# EAGLE board boardV1-4 (EAGLE 6.5.0), part 1 of 2
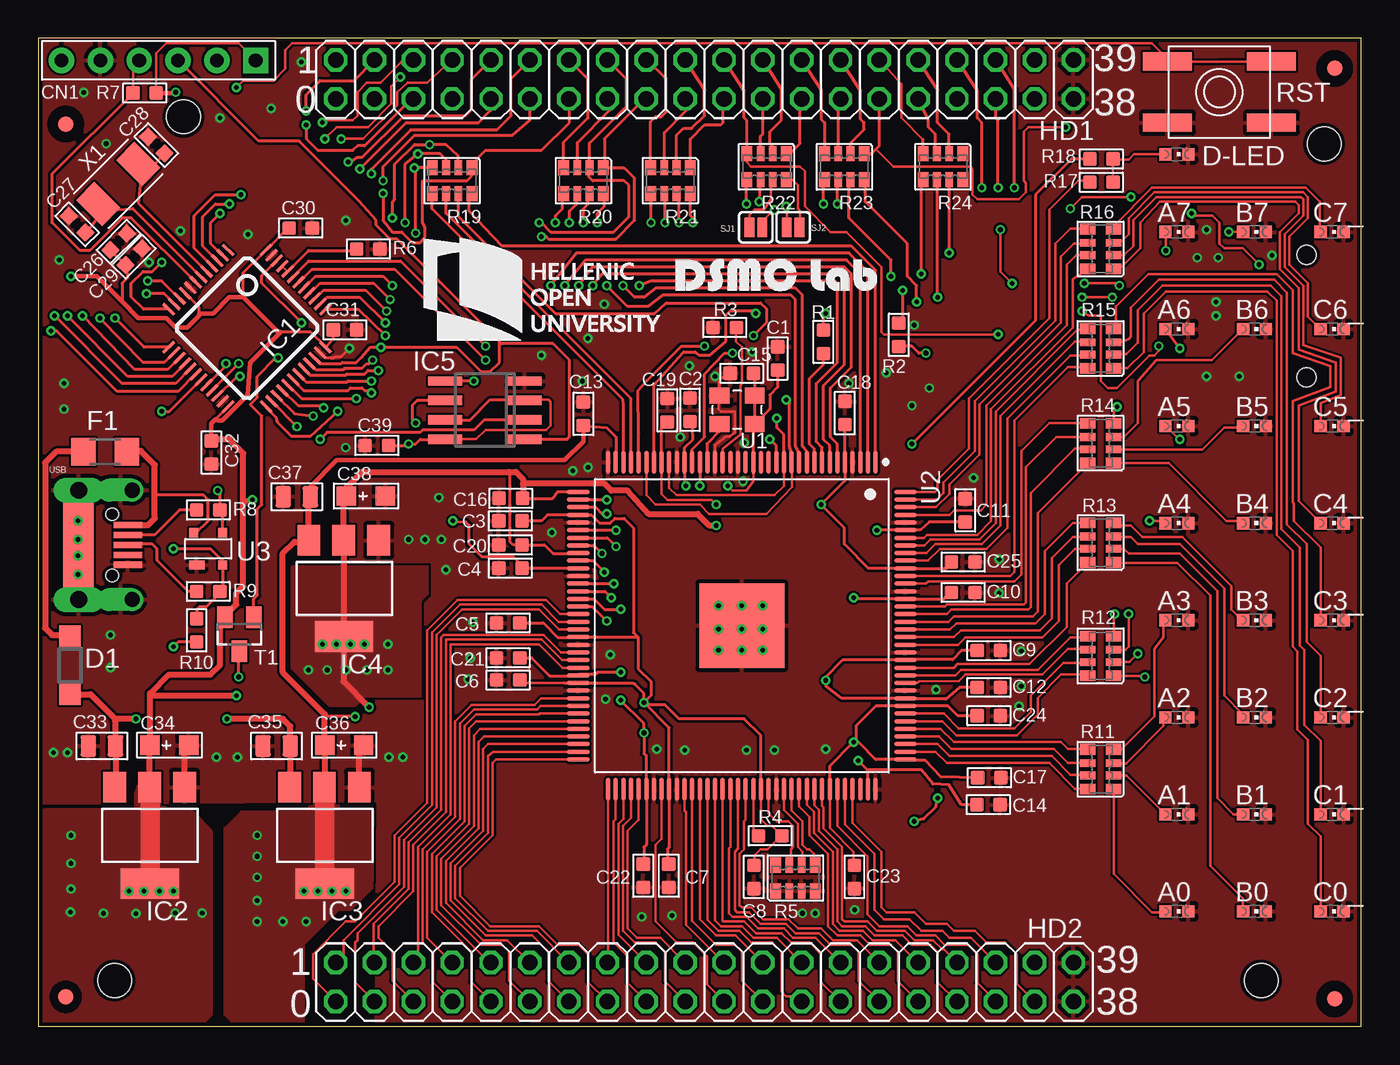
[diagram p7: board, top side]
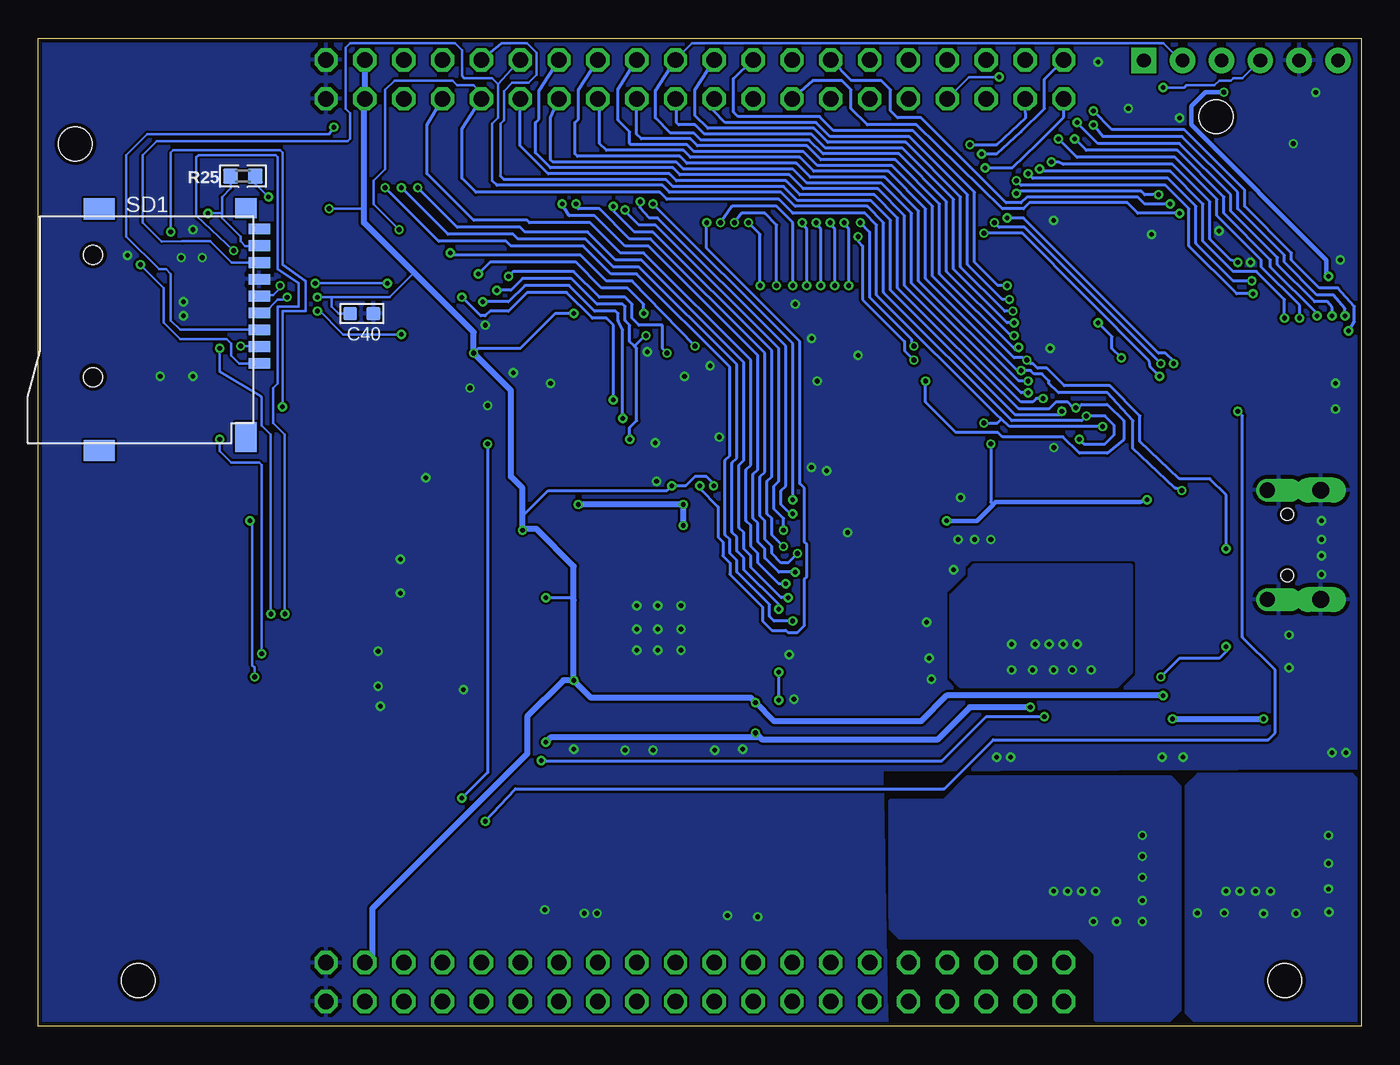
[diagram p8: board, bottom side, seen from below]

Size 86.54 x 64.64 mm. Coordinates in mm from the lower left corner, seen from the top.
Outline: 0,0 86.54,0 86.54,64.64 0,64.64 0,0
Copper layers (1*16): Top 0.035mm / dielectric 1.5mm / Bottom 0.035mm
Design rules "SeeedStudio_2layer_DRU_no_angle_20140221": minimum track width 6mil, minimum drill 12mil, track to track 6mil, track to pad 6mil, pad to pad 6mil, via to via 6mil, smd to smd 0mil, copper to edge 10mil, drill to drill 10mil, minimum pad ring 10mil, minimum via ring 6mil, stop-mask expansion 2mil, vias tented up to drill 100mil, thermal gap 10mil
Holes 2.2 mm at 5,3 80,3 84.11,57.73 9.5,59.5

## Footprints (pad centres in the part's own frame; a part is rotated, then mirrored left to right if it is on the bottom)
CHIPLED_0603 = smd 0.8 x 0.8: A 0,-0.75; C 0,0.75
C0603 = smd 0.889 x 0.889: 1 0,0.762; 2 0,-0.762
C0805 = smd 1.397 x 1.016: 1 0,0.889; 2 0,-0.889
AVX-A = smd 1.27 x 1.27: + -1.27,0; - 1.27,0
H6-2.54 = drill 0.889 pad 1.651 square: 1 0,6.35 | drill 0.889 pad 1.651: 2 0,3.81; 3 0,1.27; 4 0,-1.27; 5 0,-3.81; 6 0,-6.35
SOD123 = smd 1.4 x 1.4: A 1.9,0; C -1.9,0
R1206 = smd 1.6 x 1.803: 1 -1.422,0; 2 1.422,0
2X20 = drill 1.016 octagon: 1 -24.13,-1.27; 2 -24.13,1.27; 3 -21.59,-1.27; 4 -21.59,1.27; 5 -19.05,-1.27; 6 -19.05,1.27; 7 -16.51,-1.27; 8 -16.51,1.27; 9 -13.97,-1.27; 10 -13.97,1.27; 11 -11.43,-1.27; 12 -11.43,1.27; 13 -8.89,-1.27; 14 -8.89,1.27; 15 -6.35,-1.27; 16 -6.35,1.27; 17 -3.81,-1.27; 18 -3.81,1.27; 19 -1.27,-1.27; 20 -1.27,1.27; 21 1.27,-1.27; 22 1.27,1.27; 23 3.81,-1.27; 24 3.81,1.27; 25 6.35,-1.27; 26 6.35,1.27; 27 8.89,-1.27; 28 8.89,1.27; 29 11.43,-1.27; 30 11.43,1.27; 31 13.97,-1.27; 32 13.97,1.27; 33 16.51,-1.27; 34 16.51,1.27; 35 19.05,-1.27; 36 19.05,1.27; 37 21.59,-1.27; 38 21.59,1.27; 39 24.13,-1.27; 40 24.13,1.27
TQFP48 = smd 0.2 x 1: 1 -2.75,-4.5; 2 -2.25,-4.5; 3 -1.75,-4.5; 4 -1.25,-4.5; 5 -0.75,-4.5; 6 -0.25,-4.5; 7 0.25,-4.5; 8 0.75,-4.5; 9 1.25,-4.5; 10 1.75,-4.5; 11 2.25,-4.5; 12 2.75,-4.5; 25 2.75,4.5; 26 2.25,4.5; 27 1.75,4.5; 28 1.25,4.5; 29 0.75,4.5; 30 0.25,4.5; 31 -0.25,4.5; 32 -0.75,4.5; 33 -1.25,4.5; 34 -1.75,4.5; 35 -2.25,4.5; 36 -2.75,4.5 | smd 1 x 0.2: 13 4.5,-2.75; 14 4.5,-2.25; 15 4.5,-1.75; 16 4.5,-1.25; 17 4.5,-0.75; 18 4.5,-0.25; 19 4.5,0.25; 20 4.5,0.75; 21 4.5,1.25; 22 4.5,1.75; 23 4.5,2.25; 24 4.5,2.75; 37 -4.5,2.75; 38 -4.5,2.25; 39 -4.5,1.75; 40 -4.5,1.25; 41 -4.5,0.75; 42 -4.5,0.25; 43 -4.5,-0.25; 44 -4.5,-0.75; 45 -4.5,-1.25; 46 -4.5,-1.75; 47 -4.5,-2.25; 48 -4.5,-2.75
SOT223 = smd 1.499 x 2.007: 1 -2.261,-3.15; 2 0.025,-3.15; 3 2.311,-3.15 | smd 3.81 x 2.007: 4 0,3.15
SO08 = smd 0.6 x 2.2: 1 -1.905,-2.6; 2 -0.635,-2.6; 3 0.635,-2.6; 4 1.905,-2.6; 5 1.905,2.6; 6 0.635,2.6; 7 -0.635,2.6; 8 -1.905,2.6
R0603 = smd 0.889 x 0.889: 1 0,0.762; 2 0,-0.762
RA1206-8 = smd 0.7 x 1: 1 -1.3,-0.85; 4 1.3,-0.85; 5 1.3,0.85; 8 -1.3,0.85 | smd 0.5 x 1: 2 -0.4,-0.85; 3 0.4,-0.85; 6 0.4,0.85; 7 -0.4,0.85
0603$1 = smd 1 x 1: 1 -0.8,0; 2 0.8,0
EVQ-Q2 = smd 3.2 x 1.2: A -3.4,-2; A' 3.4,-2; B -3.4,2; B' 3.4,2
TF-PULL = smd 0.7 x 1.4: 1 -2.2,-7.62; 2 -1.1,-7.62; 3 0,-7.62; 4 1.1,-7.62; 5 2.2,-7.62; 6 3.3,-7.62; 7 4.4,-7.62; 8 5.5,-7.62; 9 6.6,-7.62 | smd 1.4 x 2: S1 -7.9,2.85; S2 7.9,2.85 | smd 1.28 x 1.4: S3 7.96,-6.75 | smd 1.95 x 1.4: S4 -7.025,-6.75 | hole 1.25: -3.1,3.25; 4.9,3.25
SPARKFUN_SJ_2S = smd 0.635 x 1.27: 1 -0.412,0; 2 0.412,0
SOT23 = smd 1 x 1.4: 1 -0.95,-1.1; 2 0.95,-1.1; 3 0,1.1
X3225_4P = smd 1.3 x 1.05: P$1 -1.15,-0.925; P$2 1.15,-0.925; P$3 1.15,0.925; P$4 -1.15,0.925
QFP50P2200X2200X165-145N = smd 1.5 x 0.3: 1 -10.7,8.75; 2 -10.7,8.25; 3 -10.7,7.75; 4 -10.7,7.25; 5 -10.7,6.75; 6 -10.7,6.25; 7 -10.7,5.75; 8 -10.7,5.25; 9 -10.7,4.75; 10 -10.7,4.25; 11 -10.7,3.75; 12 -10.7,3.25; 13 -10.7,2.75; 14 -10.7,2.25; 15 -10.7,1.75; 16 -10.7,1.25; 17 -10.7,0.75; 18 -10.7,0.25; 19 -10.7,-0.25; 20 -10.7,-0.75; 21 -10.7,-1.25; 22 -10.7,-1.75; 23 -10.7,-2.25; 24 -10.7,-2.75; 25 -10.7,-3.25; 26 -10.7,-3.75; 27 -10.7,-4.25; 28 -10.7,-4.75; 29 -10.7,-5.25; 30 -10.7,-5.75; 31 -10.7,-6.25; 32 -10.7,-6.75; 33 -10.7,-7.25; 34 -10.7,-7.75; 35 -10.7,-8.25; 36 -10.7,-8.75; 73 10.7,-8.75; 74 10.7,-8.25; 75 10.7,-7.75; 76 10.7,-7.25; 77 10.7,-6.75; 78 10.7,-6.25; 79 10.7,-5.75; 80 10.7,-5.25; 81 10.7,-4.75; 82 10.7,-4.25; 83 10.7,-3.75; 84 10.7,-3.25; 85 10.7,-2.75; 86 10.7,-2.25; 87 10.7,-1.75; 88 10.7,-1.25; 89 10.7,-0.75; 90 10.7,-0.25; 91 10.7,0.25; 92 10.7,0.75; 93 10.7,1.25; 94 10.7,1.75; 95 10.7,2.25; 96 10.7,2.75; 97 10.7,3.25; 98 10.7,3.75; 99 10.7,4.25; 100 10.7,4.75; 101 10.7,5.25; 102 10.7,5.75; 103 10.7,6.25; 104 10.7,6.75; 105 10.7,7.25; 106 10.7,7.75; 107 10.7,8.25; 108 10.7,8.75 | smd 0.3 x 1.5: 37 -8.75,-10.7; 38 -8.25,-10.7; 39 -7.75,-10.7; 40 -7.25,-10.7; 41 -6.75,-10.7; 42 -6.25,-10.7; 43 -5.75,-10.7; 44 -5.25,-10.7; 45 -4.75,-10.7; 46 -4.25,-10.7; 47 -3.75,-10.7; 48 -3.25,-10.7; 49 -2.75,-10.7; 50 -2.25,-10.7; 51 -1.75,-10.7; 52 -1.25,-10.7; 53 -0.75,-10.7; 54 -0.25,-10.7; 55 0.25,-10.7; 56 0.75,-10.7; 57 1.25,-10.7; 58 1.75,-10.7; 59 2.25,-10.7; 60 2.75,-10.7; 61 3.25,-10.7; 62 3.75,-10.7; 63 4.25,-10.7; 64 4.75,-10.7; 65 5.25,-10.7; 66 5.75,-10.7; 67 6.25,-10.7; 68 6.75,-10.7; 69 7.25,-10.7; 70 7.75,-10.7; 71 8.25,-10.7; 72 8.75,-10.7; 109 8.75,10.7; 110 8.25,10.7; 111 7.75,10.7; 112 7.25,10.7; 113 6.75,10.7; 114 6.25,10.7; 115 5.75,10.7; 116 5.25,10.7; 117 4.75,10.7; 118 4.25,10.7; 119 3.75,10.7; 120 3.25,10.7; 121 2.75,10.7; 122 2.25,10.7; 123 1.75,10.7; 124 1.25,10.7; 125 0.75,10.7; 126 0.25,10.7; 127 -0.25,10.7; 128 -0.75,10.7; 129 -1.25,10.7; 130 -1.75,10.7; 131 -2.25,10.7; 132 -2.75,10.7; 133 -3.25,10.7; 134 -3.75,10.7; 135 -4.25,10.7; 136 -4.75,10.7; 137 -5.25,10.7; 138 -5.75,10.7; 139 -6.25,10.7; 140 -6.75,10.7; 141 -7.25,10.7; 142 -7.75,10.7; 143 -8.25,10.7; 144 -8.75,10.7 | smd 5.55 x 5.55: 145 0,0
SOT-143B = smd 1 x 0.6: 1 -0.75,-1.05 | smd 0.6 x 0.6: 2 0.95,-1.05; 3 0.95,1.05; 4 -0.95,1.05
FIDUCIAL_1MM = smd 1 x 1: 1 0,0
MICRO_USB_4_LEGS = smd 1.85 x 0.4: D+ 3.125,0; D- 3.125,0.65; GND 3.125,-1.3; ID 3.125,-0.65; VCC 3.125,1.3 | drill 1.1 pad 1.5 long: DIPGND1 -0.1,3.575; DIPGND3 -0.1,-3.575 | drill 1 pad 1.5 offset: DIPGND2 3.4,3.575; DIPGND4 3.4,-3.575 | smd 2 x 6: P$4 -0.1,0 | hole 0.8: 2.1,2; 2.1,-2
X5032_2P = smd 1.7 x 2.4: P$1 -1.85,0; P$2 1.85,0

## Placement (x,y rotation side)
A0  [CHIPLED_0603]  74.47,7.52 270 top
A1  [CHIPLED_0603]  74.47,13.87 270 top
A2  [CHIPLED_0603]  74.47,20.22 270 top
A3  [CHIPLED_0603]  74.47,26.57 270 top
A4  [CHIPLED_0603]  74.47,32.92 270 top
A5  [CHIPLED_0603]  74.47,39.27 270 top
A6  [CHIPLED_0603]  74.47,45.62 270 top
A7  [CHIPLED_0603]  74.47,51.97 270 top
B0  [CHIPLED_0603]  79.55,7.52 270 top
B1  [CHIPLED_0603]  79.55,13.87 270 top
B2  [CHIPLED_0603]  79.55,20.22 270 top
B3  [CHIPLED_0603]  79.55,26.57 270 top
B4  [CHIPLED_0603]  79.55,32.92 270 top
B5  [CHIPLED_0603]  79.55,39.27 270 top
B6  [CHIPLED_0603]  79.55,45.62 270 top
B7  [CHIPLED_0603]  79.55,51.97 270 top
C0_  [CHIPLED_0603]  84.63,7.52 270 top
C1  100nf  [C0603]  48.37,43.69 180 top
C1_  [CHIPLED_0603]  84.63,13.87 270 top
C2  100nf  [C0603]  42.64,40.34 180 top
C2_  [CHIPLED_0603]  84.63,20.22 270 top
C3  100nf  [C0603]  30.89,33.07 270 top
C3_  [CHIPLED_0603]  84.63,26.57 270 top
C4  100nf  [C0603]  30.89,29.97 270 top
C4_  [CHIPLED_0603]  84.63,32.92 270 top
C5  100nf  [C0603]  30.73,26.39 270 top
C5_  [CHIPLED_0603]  84.63,39.27 270 top
C6  100nf  [C0603]  30.73,22.66 270 top
C6_  [CHIPLED_0603]  84.63,45.62 270 top
C7  100nf  [C0603]  41.25,9.86 0 top
C7_  [CHIPLED_0603]  84.63,51.97 270 top
C8  100nf  [C0603]  46.81,9.78 0 top
C9  100nf  [C0603]  62.18,24.58 90 top
C10  100nf  [C0603]  60.5,28.38 90 top
C11  100nf  [C0603]  60.64,33.76 180 top
C12  100nf  [C0603]  62.18,22.17 90 top
C13  100nf  [C0603]  35.66,40.07 180 top
C14  100nf  [C0603]  62.15,14.5 90 top
C15  100nf  [C0603]  46.02,42.72 90 top
C16  100nf  [C0603]  30.91,34.54 270 top
C17  100nf  [C0603]  62.22,16.27 90 top
C18  100nf  [C0603]  52.77,40.12 180 top
C19  100nf  [C0603]  41.15,40.3 180 top
C20  100nf  [C0603]  30.89,31.5 270 top
C21  100nf  [C0603]  30.73,24.1 270 top
C22  100nf  [C0603]  39.57,9.86 0 top
C23  100nf  [C0603]  53.39,9.78 0 top
C24  100nf  [C0603]  62.18,20.32 90 top
C25  100nf  [C0603]  60.5,30.38 90 top
C26  10nf  [C0603]  5.26,51.33 315 top
C27  36pf  [C0603]  2.54,52.48 45 top
C28  36pf  [C0603]  7.72,57.66 45 top
C29  1uf  [C0603]  6.25,50.34 315 top
C30  1uf  [C0603]  17.17,52.22 90 top
C31  1uf  [C0603]  20.07,45.57 90 top
C32  1uf  [C0603]  11.33,37.54 0 top
C33  10uf  [C0805]  4.17,18.34 90 top
C34  22uf  [AVX-A]  8.59,18.39 0 top
C35  10uf  [C0805]  15.6,18.34 90 top
C36  22uf  [AVX-A]  20.02,18.39 0 top
C37  10uf  [C0805]  16.92,34.65 90 top
C38  22uf  [AVX-A]  21.44,34.7 0 top
C39  100nf  [C0603]  22.15,38 90 top
C40  100nf  [C0603]  65.38,46.63 270 bottom
CN1  6p-2.54  [H6-2.54]  7.87,63.2 270 top
D1  MBR0520LT  [SOD123]  2.08,23.62 90 top
D-LED  [CHIPLED_0603]  74.47,57.05 270 top
F1  .75A  [R1206]  4.37,37.59 180 top
HD1  [2X20]  43.59,61.95 0 top
HD2  [2X20]  43.59,2.9 0 top
IC1  STM32F10XCXT6  [TQFP48]  13.67,45.67 225 top
IC2  REG1117  [SOT223]  7.32,12.5 180 top
IC3  REG1117  [SOT223]  18.75,12.5 180 top
IC4  REG1117  [SOT223]  20.02,28.65 180 top
IC5  ST95P08M  [SO08]  29.22,40.31 90 top
R1  10K  [R0603]  51.36,44.78 0 top
R2  10K  [R0603]  56.29,45.24 180 top
R3  10K  [R0603]  44.91,45.72 90 top
R4  10K  [R0603]  47.88,12.47 270 top
R5  1K  [RA1206-8]  49.53,9.7 0 top
R6  10K 1/10W  [R0603]  21.59,50.85 270 top
R7  10K 1/10W  [R0603]  6.96,61.06 90 top
R8  22R  [R0603]  11.13,33.78 90 top
R9  22R  [R0603]  11.13,28.45 90 top
R10  1.5K  [R0603]  10.36,25.91 180 top
R11  1K  [RA1206-8]  69.49,16.81 90 top
R12  1K  [RA1206-8]  69.49,24.23 90 top
R13  1K  [RA1206-8]  69.49,31.65 90 top
R14  1K  [RA1206-8]  69.49,38.15 90 top
R15  1K  [RA1206-8]  69.49,44.35 90 top
R16  1K  [RA1206-8]  69.49,50.85 90 top
R17  1K 1/10W  [R0603]  69.55,55.22 270 top
R18  1K 1/10W  [R0603]  69.55,56.74 270 top
R19  1K  [RA1206-8]  27.08,55.32 180 top
R20  1K  [RA1206-8]  35.66,55.32 180 top
R21  1K  [RA1206-8]  41.35,55.32 180 top
R22  1K  [RA1206-8]  47.65,56.24 180 top
R23  1K  [RA1206-8]  52.73,56.24 180 top
R24  1K  [RA1206-8]  59.18,56.24 180 top
R25  [0603$1]  73.15,55.63 180 bottom
RST  SPST_TACT-EVQQ2  [EVQ-Q2]  77.27,61.11 180 top
SD1  TF-HOLDER  [TF-PULL]  79.71,45.57 90 bottom
SJ1  SPARKFUN_SOLDERJUMPERNC  [SPARKFUN_SJ_2S]  46.94,52.27 180 top
SJ2  SPARKFUN_SOLDERJUMPERNC  [SPARKFUN_SJ_2S]  49.38,52.27 0 top
T1  PDTA114ET  [SOT23]  13.16,25.65 180 top
U1  306020041_OSC_32.768KHZ-3225_4P  [X3225_4P]  45.72,40.34 180 top
U2  EP4CE6E22C8N  [QFP50P2200X2200X165-145N]  46.02,26.21 270 top
U3  PRTR5V0U2X  [SOT-143B]  11.13,31.24 0 top
U$1  FIDUCIAL  [FIDUCIAL_1MM]  1.8,1.93 0 top
U$2  FIDUCIAL  [FIDUCIAL_1MM]  84.8,1.8 0 top
U$3  FIDUCIAL  [FIDUCIAL_1MM]  84.8,62.67 0 top
U$4  FIDUCIAL  [FIDUCIAL_1MM]  1.8,59.03 0 top
USB  MICRO-USB-B  [MICRO_USB_4_LEGS]  2.74,31.5 0 top
X1  306010047_XTAL_12MHZ-5032_2P  [X5032_2P]  5.23,55.12 225 top